# Altium schematic sheet InterfaceBoard_1.SchDoc: SPEXTRO - INTERFACE BOARD
size A4; Author: Derek Belsky; Revision: 0; SheetNumber: 2; SheetTotal: 2
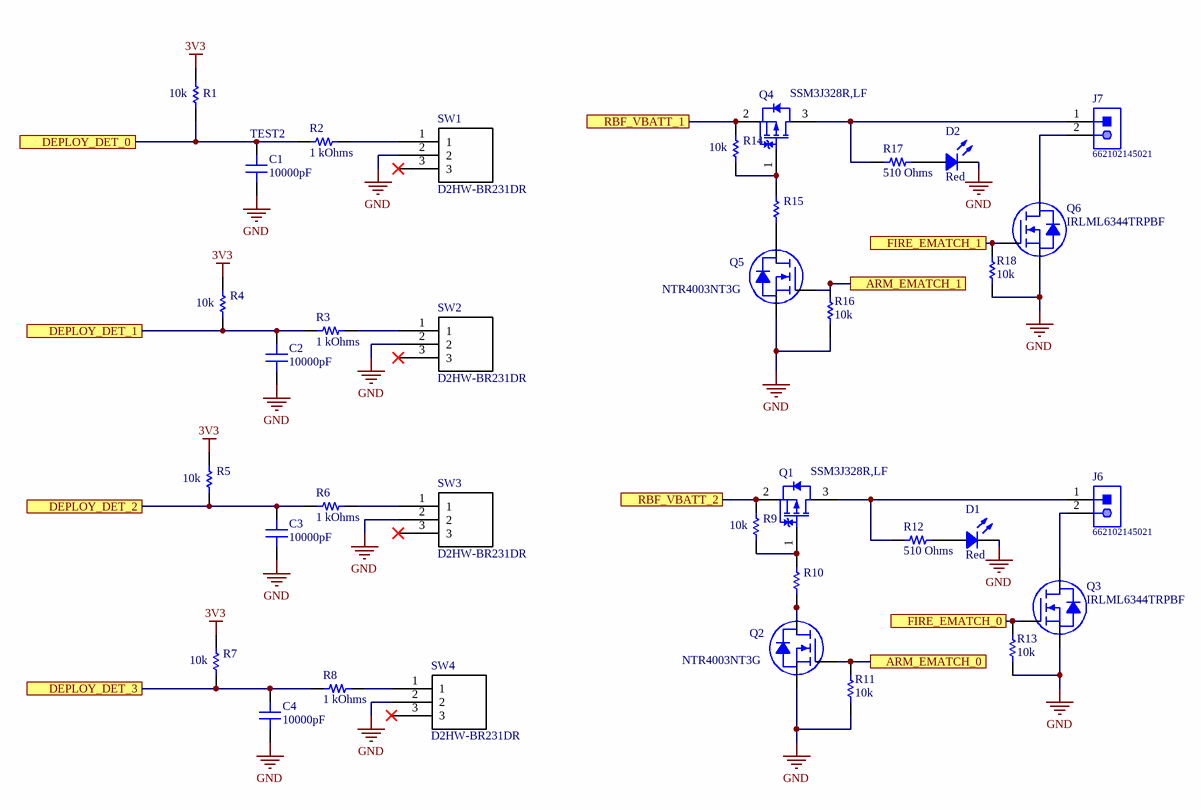
[diagram p0: InterfaceBoard_1.SchDoc]

## Parts
C1  10000pF  [CAP 0603_1608]
C2  10000pF  [CAP 0603_1608]
C3  10000pF  [CAP 0603_1608]
C4  10000pF  [CAP 0603_1608]
D1  Red  [LED 1206_3216 RED]
D2  Red  [LED 1206_3216 RED]
J6  662102145021  [662102145021]
J7  662102145021  [662102145021]
Q1  SSM3J328R,LF  [TOSH-SOT-23F_V]
Q2  NTR4003NT3G  [ON SEMI SOT-23-3]
Q3  IRLML6344TRPBF  [INFINEON SOT-23-3]
Q4  SSM3J328R,LF  [TOSH-SOT-23F_V]
Q5  NTR4003NT3G  [ON SEMI SOT-23-3]
Q6  IRLML6344TRPBF  [INFINEON SOT-23-3]
R1  value 10k  [RES 0603_1608]  (hidden comment: 1 kOhms)
R2  1 kOhms  [RES 0603_1608]
R3  1 kOhms  [RES 0603_1608]
R4  value 10k  [RESC1609X50X30NL8T20]  (hidden comment: CRCW060310K0FKEA)
R5  value 10k  [RES 0603_1608]  (hidden comment: 1 kOhms)
R6  value 1 kOhms  [RESC1609X50X30NL8T20]  (hidden comment: CRCW060310K0FKEA)
R7  value 10k  [RES 0603_1608]  (hidden comment: 1 kOhms)
R8  value 1 kOhms  [RESC1609X50X30NL8T20]  (hidden comment: CRCW060310K0FKEA)
R9  value 10k  [RESC1609X50X30NL8T20]  (hidden comment: CRCW060310K0FKEA)
R10  CRCW060312K0FKEA  [RESC1609X50X30LL10T20]  (value not drawn)
R11  value 10k  [RESC1609X50X30NL8T20]  (hidden comment: CRCW060310K0FKEA)
R12  510 Ohms  [RES 0603_1608]
R13  value 10k  [RESC1609X50X30NL8T20]  (hidden comment: CRCW060310K0FKEA)
R14  value 10k  [RESC1609X50X30NL8T20]  (hidden comment: CRCW060310K0FKEA)
R15  CRCW060312K0FKEA  [RESC1609X50X30LL10T20]  (value not drawn)
R16  value 10k  [RESC1609X50X30NL8T20]  (hidden comment: CRCW060310K0FKEA)
R17  510 Ohms  [RES 0603_1608]
R18  value 10k  [RESC1609X50X30NL8T20]  (hidden comment: CRCW060310K0FKEA)
SW1  D2HW-BR231DR
SW2  D2HW-BR231DR
SW3  D2HW-BR231DR
SW4  D2HW-BR231DR

## Ports
ARM_EMATCH_0, ARM_EMATCH_1, DEPLOY_DET_0, DEPLOY_DET_1, DEPLOY_DET_2, DEPLOY_DET_3, FIRE_EMATCH_0, FIRE_EMATCH_1, RBF_VBATT_1, RBF_VBATT_2

## Nets
3V3: R1.2 R4.2 R5.2 R7.2
GND: C1.1 C2.1 C3.1 C4.1 D1.2 D2.2 Q2.2(S) Q3.2(S) Q5.2(S) Q6.2(S) R11.2 R13.2 R16.2 R18.2 SW1.2 SW2.2 SW3.2 SW4.2
ARM_EMATCH_0: Q2.1(G) R11.1 ; port ARM_EMATCH_0
ARM_EMATCH_1: Q5.1(G) R16.1 ; port ARM_EMATCH_1
DEPLOY_DET_0: C1.2 R1.2 R2.1 ; port DEPLOY_DET_0
DEPLOY_DET_1: C2.2 R3.1 R4.1 ; port DEPLOY_DET_1
DEPLOY_DET_2: C3.2 R5.2 R6.1 ; port DEPLOY_DET_2
DEPLOY_DET_3: C4.2 R7.2 R8.1 ; port DEPLOY_DET_3
FIRE_EMATCH_0: Q3.1(G) R13.1 ; port FIRE_EMATCH_0
FIRE_EMATCH_1: Q6.1(G) R18.1 ; port FIRE_EMATCH_1
RBF_VBATT_1: Q4.2(S) R14.2 ; port RBF_VBATT_1
RBF_VBATT_2: Q1.2(S) R9.2 ; port RBF_VBATT_2
NetD1_1: D1.1 R12.2
NetD2_1: D2.1 R17.2
NetJ6_1: J6.1 Q1.3(D) R12.1
NetJ6_2: J6.2 Q3.3(D)
NetJ7_1: J7.1 Q4.3(D) R17.1
NetJ7_2: J7.2 Q6.3(D)
NetQ1_1: Q1.1(G) R9.1 R10.2
NetQ2_3: Q2.3(D) R10.1
NetQ4_1: Q4.1(G) R14.1 R15.2
NetQ5_3: Q5.3(D) R15.1
NetR2_2: R2.2 SW1.1
NetR3_2: R3.2 SW2.1
NetR6_2: R6.2 SW3.1
NetR8_2: R8.2 SW4.1

Not connected (* = marked no-connect by the designer): SW1 3*; SW2 3*; SW3 3*; SW4 3*

## Notes on the sheet
- (near C1) TEST2
- Title
- Size:
- Date:
- A4
- Author
- Time:
- Sheet
- Revision:
- of
- RIT Space Exploration Team
- Rochester Institute of Technology
- 1 Lomb Memorial Drive
- Rochester, NY 14623
- https://spex.rit.edu
- File:

## Library data of the parts
C1-C4 = C0603S103K4RACTU: CAP CER 10000PF 16V X7R 0603; Manufacturer: KEMET; Tolerance: ±10%; Part Number: C0603S103K4RACTU; Value: 10000pF; Applications: Boardflex Sensitive; Capacitance: 10000pF; ComponentLink1Description: Datasheet; ComponentLink1URL: https://api.kemet.com/component-edge/download/datasheet/C0603S103K4RACTU.pdf; ComponentLink2Description: DigiKey Link; ComponentLink2URL: http://digikey.com/product-detail/en/kemet/C0603S103K4RACTU/399-9135-1-ND/3522653; Device Package: 0603 (1608 Metric); Features: Floating Electrode; LastUpdated: 1/21/2020 12:02:08 AM; Lifecycle Status: Active; Minimum Order: 1; Mounting Type: Surface Mount, MLCC; Operating Temperature: -55°C ~ 125°C; Package / Case: 0603 (1608 Metric); Packaging: TapeAndReel; PartId: 3312; Part Status: Active; Price: 0.07; Series: SMD Comm X7R FE; Size / Dimension: 0.063" L x 0.031" W (1.60mm x 0.80mm); Supplier 1: DigiKey; Supplier Part Number 1: 399-9135-1-ND; Temperature Coefficient: X7R; Thickness (Max): 0.034" (0.87mm); Voltage - Rated: 16V
D1 D2 = HSMC-C350: LED RED CHIP SMD; Manufacturer: Broadcom Limited; Configuration: Standard; Current - Test: 20mA; Lens Color: 1.20mm; Lens Size: 1.10mm Dia; Lens Style: Round with Domed Top; Viewing Angle: 70°; Voltage - Forward (Vf) (Typ): 2V; Wavelength - Dominant: 630nm; Wavelength - Peak: 643nm; Part Number: HSMC-C350; Color: Red; ComponentLink1Description: Datasheet; ComponentLink1URL: https://docs.broadcom.com/docs/HSMC-C350-DS100; ComponentLink2Description: DigiKey Link; ComponentLink2URL: http://digikey.com/product-detail/en/broadcom-limited/HSMC-C350/516-4369-1-ND/10239796; Device Package: 1206 (3216 Metric); Height (Max): 1.20mm; LastUpdated: 1/21/2020 3:14:28 AM; Lifecycle Status: Active; Minimum Order: 1; Mounting Type: Surface Mount; Package / Case: 1206 (3216 Metric); Packaging: TapeAndReel; PartId: 195; Part Status: Active; Price: 0.21; Series: -; Size / Dimension: 3.20mm L x 1.60mm W; Supplier 1: DigiKey; Supplier Part Number 1: 516-4369-1-ND; Supplier Device Package: Chip LED; Value: Red
J6 J7 = CMP-1502-00482-1: SMT Male Header WR-MPC3, with SMT Solder Tabs, Right Angled, Single Row, pitch 3 mm, 2 pins; Manufacturer: Wurth Elektronik; Contact Resistance: 10mOhm; Working Voltage: 250VAC; Pitch: 3mm; Pin Number: 2; Mounting Technology: SMT; Orientation: RightAngled; Part Number: 662102145021; Datasheet URL: https://katalog.we-online.de/em/datasheet/6621xx145021.pdf; Manufacturer URL: http://www.we-online.de; Packaging: TapeandReel; Publisher: WurthElektronik; Gender: Male; Operating Temperature: -40to105degC; Package Reference: 662102145021
Q1 Q4 = CMP-2100-03686-1: TOSHIBA Field-Effect Transistor Silicon P-Channel MOS Type (U-MOS VI), 20 V, -55 to 125 degC, 3-Pin SOTFL, RoHS, Tape and Reel; Gate to Source Voltage (Vgs): 8V; Drain to Source Breakdown Voltage: -20V; Turn-Off Delay Time: 107ns; Continuous Drain Current (ID): 6A; Rds On Max: 29.8mOhm; Number of Elements: 1; Turn-On Delay Time: 32ns; Drain to Source Resistance: 47.4mOhm; Drain to Source Voltage (Vdss): 20V; Power Dissipation: 2W; Element Configuration: Single; Max Power Dissipation: 1W; Input Capacitance: 840pF; Manufacturer URL: http://www.toshiba.com/; Number of Pins: 3; Number of Channels: 1; Max Operating Temperature: 150degC; Min Operating Temperature: -55degC; Manufacturer: Toshiba; Mount: SurfaceMount; Package Description: 3-Pin Small Outline Transistor, Flat Lead, Body 2.9 x 1.8 mm, Pitch 0.95 mm; Radiation Hardening: No; Package Quantity: 3000; Package Reference: SOT-23F; RoHSCompliant: true; Package URL: https://toshiba.semicon-storage.com/ap-en/design-support/package/detail.SOT-23F.html; Packaging: TapeandReel; Datasheet Version: 41699.0; Case/Package: SOT-23-3; Datasheet URL: https://toshiba.semicon-storage.com/info/docget.jsp?did=2429&prodName=SSM3J328R
Q2 Q5 = NTR4003NT3G: MOSFET N-CH 30V 500MA SOT-23; Manufacturer: ON Semiconductor; Current - Continuous Drain (Id) @ 25°C: 500mA (Ta); Drive Voltage (Max Rds On,  Min Rds On): 2.5V, 4V; FET Type: N-Channel; Gate Charge (Qg) (Max) @ Vgs: 1.15nC @ 5V; Input Capacitance (Ciss) (Max) @ Vds: 21pF @ 5V; Power Dissipation (Max): 690mW (Ta); Rds On (Max) @ Id, Vgs: 1.5Ohm @ 10mA, 4V; Vgs (Max): ±20V; Vgs(th) (Max) @ Id: 1.4V @ 250µA; Part Number: NTR4003NT3G; ComponentLink1Description: Datasheet; ComponentLink1URL: http://www.onsemi.com/pub/Collateral/NTR4003N-D.PDF; ComponentLink2Description: DigiKey Link; ComponentLink2URL: http://digikey.com/product-detail/en/on-semiconductor/NTR4003NT3G/NTR4003NT3GOSCT-ND/1967271; Device Package: TO-236-3, SC-59, SOT-23-3; Drain to Source Voltage (Vdss): 30V; LastUpdated: 1/21/2020 4:01:12 AM; Lifecycle Status: Active; Minimum Order: 1; Mounting Type: Surface Mount; Operating Temperature: -55°C ~ 150°C (TJ); Package / Case: TO-236-3, SC-59, SOT-23-3; Packaging: TapeAndReel; Part Status: Active; Price: 0.04; Series: -; Supplier 1: DigiKey; Supplier Part Number 1: NTR4003NT3GOSCT-ND; Supplier Device Package: SOT-23-3 (TO-236); Technology: MOSFET (Metal Oxide)
Q3 Q6 = IRLML6344TRPBF: MOSFET N-CH 30V 5A SOT23; Manufacturer: Infineon Technologies; Current - Continuous Drain (Id) @ 25°C: 5A (Ta); Drive Voltage (Max Rds On,  Min Rds On): 2.5V, 4.5V; FET Type: N-Channel; Gate Charge (Qg) (Max) @ Vgs: 6.8nC @ 4.5V; Input Capacitance (Ciss) (Max) @ Vds: 650pF @ 25V; Power Dissipation (Max): 1.3W (Ta); Rds On (Max) @ Id, Vgs: 29mOhm @ 5A, 4.5V; Vgs (Max): ±12V; Vgs(th) (Max) @ Id: 1.1V @ 10µA; Part Number: IRLML6344TRPBF; ComponentLink1Description: Datasheet; ComponentLink1URL: https://www.infineon.com/dgdl/irlml6344pbf.pdf?fileId=5546d462533600a4015356689c44262c; ComponentLink2Description: DigiKey Link; ComponentLink2URL: http://digikey.com/product-detail/en/infineon-technologies/IRLML6344TRPBF/IRLML6344TRPBFCT-ND/2538168; Device Package: TO-236-3, SC-59, SOT-23-3; Drain to Source Voltage (Vdss): 30V; LastUpdated: 1/21/2020 4:00:48 AM; Lifecycle Status: Active; Minimum Order: 1; Mounting Type: Surface Mount; Operating Temperature: -55°C ~ 150°C (TJ); Package / Case: TO-236-3, SC-59, SOT-23-3; Packaging: TapeAndReel; Part Status: Active; Price: 0.12; Series: HEXFET®; Supplier 1: DigiKey; Supplier Part Number 1: IRLML6344TRPBFCT-ND; Supplier Device Package: Micro3™/SOT-23; Technology: MOSFET (Metal Oxide)
R1 R4 R5 R7 R9 R11 R13 R14 R16 R18 = CMP-1666-00005-4: Chip Resistor, 10 KOhm, +/- 1%, 100 mW, -55 to 155 degC, 0603 (1608 Metric), RoHS, Tape and Reel; Manufacturer: Vishay Semiconductor; Voltage Rating: 75 V; Max Operating Temperature: 155 degC; PackageDescription: 2-Pin Surface Mount Device, Body 1.575 x 0.85 mm; ComponentLink1Description: Manufacturer URL; RoHSCompliant: true; PackageReference: 0603; REACH SVHC: Unknown; Length: 1.55 mm; DatasheetVersion: 06/2012; Packaging: Tape and Reel; Min Operating Temperature: -55 degC; Mounting Technology: Surface Mount; ComponentLink2URL: https://datasheet.ciiva.com/11809/0900766b80d98afc-11809037.pdf; Height: 0.45 mm; ComponentLink2Description: Datasheet; Package Quantity: 5000; ComponentLink1URL: http://www.vishay.com/
R2 R3 R6 R8 = CPF0603B1K0E: RES SMD 1K OHM 0.1% 1/16W 0603; Manufacturer: TE Connectivity Passive Product; Power (Watts): 0.063W, 1/16W; Temperature Coefficient: ±25ppm/°C; Part Number: CPF0603B1K0E; ComponentLink1Description: Datasheet; ComponentLink1URL: https://www.te.com/commerce/DocumentDelivery/DDEController?Action=srchrtrv&DocNm=1773200&DocType=DS&DocLang=English; ComponentLink2Description: DigiKey Link; ComponentLink2URL: http://digikey.com/product-detail/en/te-connectivity-passive-product/CPF0603B1K0E/A119887CT-ND/4966485; Composition: Thin Film; Device Package: 0603 (1608 Metric); Height - Seated (Max): 0.022" (0.55mm); LastUpdated: 1/21/2020 12:24:55 AM; Lifecycle Status: Active; Minimum Order: 1; Number of Terminations: 2; Operating Temperature: -55°C ~ 155°C; Package / Case: 0603 (1608 Metric); Packaging: TapeAndReel; PartId: 4877; Part Status: Active; Price: 0.09; Resistance: 1 kOhms; Series: CPF, Neohm; Size / Dimension: 0.061" L x 0.031" W (1.55mm x 0.80mm); Supplier 1: DigiKey; Supplier Part Number 1: A119887CT-ND; Supplier Device Package: 0603; Tolerance: ±0.1%
  R2 R3: Value: 1 kOhms
R10 R15 = CMP-2000-03877-1: Manufacturer: Vishay Dale; Part Number: CRCW060312K0FKEA
R12 R17 = CRCW0603510RFKEAHP: RES SMD 510 OHM 1% 1/4W 0603; Manufacturer: Vishay Dale; Power (Watts): 0.25W, 1/4W; Temperature Coefficient: ±100ppm/°C; Part Number: CRCW0603510RFKEAHP; Value: 510 Ohms; ComponentLink1Description: Datasheet; ComponentLink1URL: http://www.vishay.com/docs/20043/crcwhpe3.pdf; ComponentLink2Description: DigiKey Link; ComponentLink2URL: http://digikey.com/product-detail/en/vishay-dale/CRCW0603510RFKEAHP/541-510SCT-ND/5326852; Composition: Thick Film; Device Package: 0603 (1608 Metric); Features: Automotive AEC-Q200, Pulse Withstanding; Height - Seated (Max): 0.022" (0.55mm); LastUpdated: 1/21/2020 12:20:58 AM; Lifecycle Status: Active; Minimum Order: 1; Number of Terminations: 2; Operating Temperature: -55°C ~ 155°C; Package / Case: 0603 (1608 Metric); Packaging: TapeAndReel; PartId: 14772; Part Status: Active; Price: 0.02; Ratings: AEC-Q200; Resistance: 510 Ohms; Series: CRCW-HP; Size / Dimension: 0.063" L x 0.033" W (1.60mm x 0.85mm); Supplier 1: DigiKey; Supplier Part Number 1: 541-510SCT-ND; Supplier Device Package: 0603; Tolerance: ±1%